# Altium schematic sheet P06_DEBUG UART_RTC_WD.SchDoc
size 420 x 297 mm
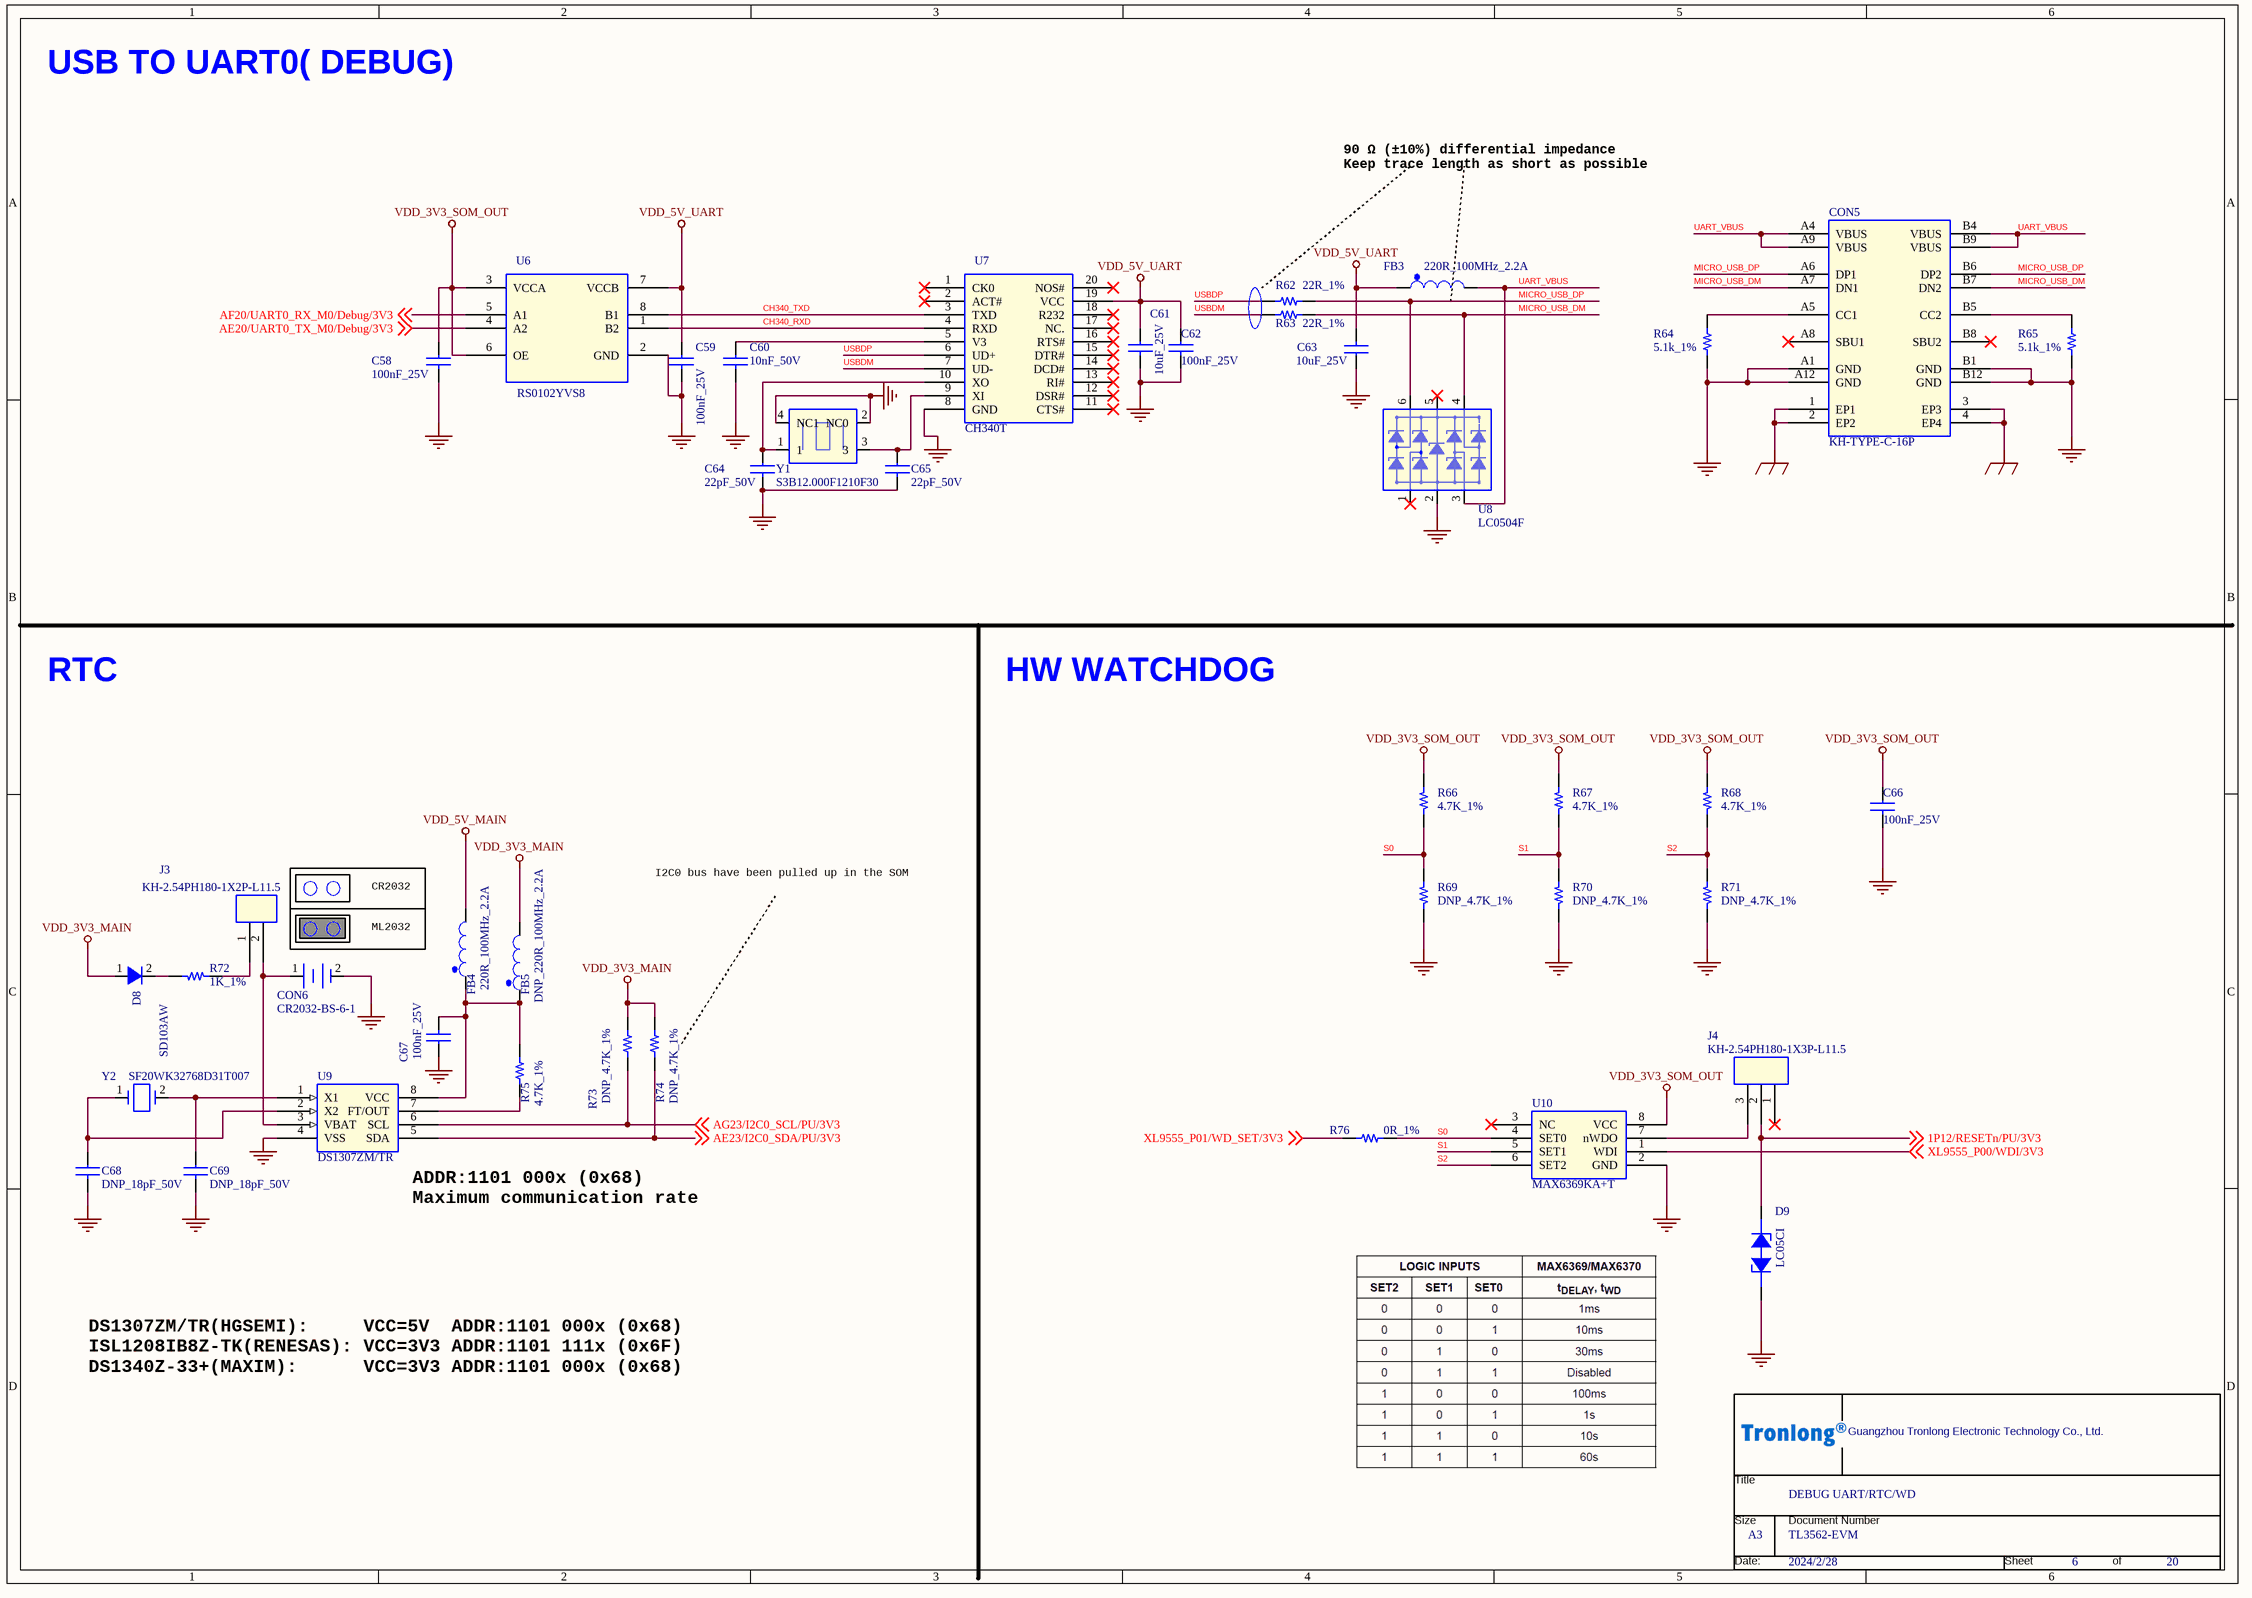
[diagram p0: P06_DEBUG UART_RTC_WD.SchDoc]

## Parts
*  Page Count: 20  Page Number: 6  Page Size: A3  OrgName: Guangzhou Tronlong Electronic Technology Co., Ltd.  Title: DEBUG UART/RTC/WD  Doc: TL3562-EVM  Page Modify Date: 2024/2/28  (hidden comment: Tronlong_TITTLE_20211115)  (graphical)
C58  100nF_25V  [C0402]
C59  100nF_25V  [C0402]
C60  10nF_50V  [C0402]
C61  10uF_25V  [C0603]
C62  100nF_25V  [C0402]
C63  10uF_25V  [C0603]
C64  22pF_50V  [C0603]
C65  22pF_50V  [C0603]
C66  100nF_25V  [C0402]
C67  100nF_25V  [C0402]
C68  DNP_18pF_50V  [C0603]
C69  DNP_18pF_50V  [C0603]
CON5  KH-TYPE-C-16P  [TYPE-C_16P_90_SMD]
CON6  CR2032-BS-6-1  [CON_BATTERY_CR2032]
D8  SD103AW  [SOD-123_NEW]
D9  LC05CI  [SOD323_BI]
FB3  220R_100MHz_2.2A  [L0603]
FB4  220R_100MHz_2.2A  [L0603]
FB5  DNP_220R_100MHz_2.2A  [L0603]
J3  KH-2.54PH180-1X2P-L11.5  [header_1x2p_2d54_male]
J4  KH-2.54PH180-1X3P-L11.5  [CON3_2D254]
R62  22R_1%  [R0402]
R63  22R_1%  [R0402]
R64  5.1k_1%  [R0402]
R65  5.1k_1%  [R0402]
R66  4.7K_1%  [R0402]
R67  4.7K_1%  [R0402]
R68  4.7K_1%  [R0402]
R69  DNP_4.7K_1%  [R0402]
R70  DNP_4.7K_1%  [R0402]
R71  DNP_4.7K_1%  [R0402]
R72  1K_1%  [R0402]
R73  DNP_4.7K_1%  [R0402]
R74  DNP_4.7K_1%  [R0402]
R75  4.7K_1%  [R0402]
R76  0R_1%  [R0402]
U6  RS0102YVS8  [SOP8-20-91]
U7  CH340T  [TSSOP-20]
U8  LC0504F  [SOT363]
U9  DS1307ZM/TR  [SOIC8_D8]
U10  MAX6369KA+T  [sot23_8]
Y1  S3B12.000F1210F30  [SMD_3225]
Y2  SF20WK32768D31T007  [SMD_2012]

## Nets
EGND: CON5.1(EP1) CON5.2(EP2) CON5.3(EP3) CON5.4(EP4)
GND: C58.2 C59.2 C60.2 C61.2 C62.2 C63.1 C64.2 C65.2 C66.2 C67.1 C68.2 C69.2 CON5.A1(GND) CON5.A12(GND) CON5.B1(GND) CON5.B12(GND) CON6.2(-) D9.2(CATHODE2) R64.2 R65.2 R69.2 R70.2 R71.2 U6.2(GND) U7.8(GND) U8.2 U9.4(VSS) U10.2(GND) Y1.2(NC0) Y1.4(NC1)
VDD_3V3_MAIN: D8.1(Anode) FB5.2 R73.1 R74.1
VDD_3V3_SOM_OUT: C58.1 C66.1 R66.1 R67.1 R68.1 U6.3(VCCA) U6.6(OE) U10.8(VCC)
VDD_5V_MAIN: FB4.2
VDD_5V_UART: C59.1 C61.1 C62.1 C63.2 FB3.1 U6.7(VCCB) U7.19(VCC)
1P12/RESETn/PU/3V3: D9.1(ANODE1) J4.2 ; off-sheet 1P12/RESETn/PU/3V3
AE20/UART0_TX_M0/Debug/3V3: U6.4(A2) ; off-sheet AE20/UART0_TX_M0/Debug/3V3
AE23/I2C0_SDA/PU/3V3: R74.2 U9.5(SDA) ; off-sheet AE23/I2C0_SDA/PU/3V3
AF20/UART0_RX_M0/Debug/3V3: U6.5(A1) ; off-sheet AF20/UART0_RX_M0/Debug/3V3
AG23/I2C0_SCL/PU/3V3: R73.2 U9.6(SCL) ; off-sheet AG23/I2C0_SCL/PU/3V3
CH340_RXD: U6.1(B2) U7.4(RXD)
CH340_TXD: U6.8(B1) U7.3(TXD)
MICRO_USB_DM: CON5.A7(DN1) CON5.B7(DN2) R63.2 U8.4
MICRO_USB_DP: CON5.A6(DP1) CON5.B6(DP2) R62.2 U8.6
S0: R66.2 R69.1 R76.1 U10.4(SET0)
S1: R67.2 R70.1 U10.5(SET1)
S2: R68.2 R71.1 U10.6(SET2)
UART_VBUS: CON5.A4(VBUS) CON5.A9(VBUS) CON5.B4(VBUS) CON5.B9(VBUS) FB3.2 U8.3
USBDM: R63.1 U7.7(UD-)
USBDP: R62.1 U7.6(UD+)
XL9555_P00/WDI/3V3: U10.1(WDI) ; off-sheet XL9555_P00/WDI/3V3
XL9555_P01/WD_SET/3V3: R76.2 ; off-sheet XL9555_P01/WD_SET/3V3
NetC60_1: C60.1 U7.5(V3)
NetC64_1: C64.1 U7.10(XO) Y1.1
NetC65_1: C65.1 U7.9(XI) Y1.3
NetC67_2: C67.2 FB4.1 FB5.1 R75.1 U9.8(VCC)
NetC68_1: C68.1 U9.2(X2) Y2.1
NetC69_1: C69.1 U9.1(X1) Y2.2
NetCON5_A5: CON5.A5(CC1) R64.1
NetCON5_B5: CON5.B5(CC2) R65.1
NetCON6_1: CON6.1(+) J3.2 U9.3(VBAT)
NetD8_2: D8.2(Cathode) R72.2
NetJ3_1: J3.1 R72.1
NetJ4_3: J4.3 U10.7(nWDO)
NetR75_2: R75.2 U9.7(FT/OUT)

Not connected (* = marked no-connect by the designer): CON5 A8(SBU1)* B8(SBU2)*; J4 1*; U7 1(CK0)* 2(ACT#)* 11(CTS#)* 12(DSR#)* 13(RI#)* 14(DCD#)* 15(DTR#)* 16(RTS#)* 17(NC.)* 18(R232)* 20(NOS#)*; U8 1* 5*; U10 3(NC)*

## Notes on the sheet
- USB TO UART0( DEBUG)
- 90 Ω (±10%) differential impedance
  Keep trace length as short as possible
- RTC
- HW WATCHDOG
- ML2032
- CR2032
- I2C0 bus have been pulled up in the SOM
- (near U9) ADDR:1101 000x (0x68)
  Maximum communication rate 100KHz
- DS1307ZM/TR(HGSEMI):     VCC=5V  ADDR:1101 000x (0x68)
  ISL1208IB8Z-TK(RENESAS): VCC=3V3 ADDR:1101 111x (0x6F)
  DS1340Z-33+(MAXIM):      VCC=3V3 ADDR:1101 000x (0x68)
- (in symbol Tronlong_TITTLE_20211115) Title; Size; Document Number; Date:; Sheet; of

## Library data of the parts
* = Tronlong_TITTLE_20211115: RevCode: A?; Page Create Date: March  8, 1995
C58 C59 C62 C66 C67 = CAP NP_Dup3: 贴片陶瓷电容,100nF,10%,25V,X5R; Manufacturer Character: 中国大陆; Operation Temperature（℃）: -55~85℃; As-Welded: /; PCB Footprint: C0402; Temperature: -55~125℃
C60 = CAP NP_Dup3: 贴片陶瓷电容,10nF,10%,50V,X7R; Manufacturer Character: 中国大陆; Operation Temperature（℃）: -55~125℃; As-Welded: /; PCB Footprint: C0402; Temperature: –55~125℃
C61 C63 = CAP NP_Dup3: 贴片陶瓷电容,10uF,10%,10V,X5R; Manufacturer Character: 中国大陆; As-Welded: /; Operation Temperature（℃）: -55~85℃; PCB Footprint: C0603; Temperature: -55~125℃
C64 C65 = CAP NP_Dup3: 贴片陶瓷电容,22pF,5%,50V,C0G; Manufacturer Character: 中国大陆; Operation Temperature（℃）: -55~125℃; As-Welded: /; PCB Footprint: C0603; Temperature: -55~125℃
C68 C69 = CAP NP_Dup3: 贴片陶瓷电容,18pF,5%,50V,C0G; Manufacturer Character: 中国大陆; Operation Temperature（℃）: -55~125℃; As-Welded: DNP; PCB Footprint: C0603; Temperature: -40~125℃
CON5 = usb 3_0.0 type-c female: Type-C 母座 90度 16 Pin; Manufacturer Character: 中国大陆; Manufacturer: 深圳市金航标电子有限公司(kinghelm); Operation Temperature（℃）: -40~85℃; room: 10; As-Welded: /; Manufacturer PartNumber: KH-TYPE-C-16P; PCB Footprint: TYPE-C_16P_90_SMD
CON6 = BATTERY: 2032,纽扣电池座,2PIN,180度,白色,卧式,贴片; Manufacturer: 深圳市琦捷电子有限公司（Q&J）; Manufacturer Character: 中国大陆; As-Welded: /; room: 4; Manufacturer PartNumber: CR2032-BS-6-1; Temperature: -55~85℃; PCB Footprint: CON_BATTERY_CR2032
D8 = Diode200mA250V_1: 肖特基二极管,VR=40V,IF=350mA,VF=0.37V@20mA,trr=10ns; TIIntPartnumber: 1E0013; MfrNum: MMSD103T1G; Mfr: On Semiconductor; Manufacturer: 江苏长晶科技有限公司（JSCJ）; Manufacturer Character: 中国大陆; DescriptiveText: Diode 200mA 250V 1.25V Forward Drop; PCB Footprint: smd123; Cost10K: 0.07; Cost100: 0.23; Vendor: Digikey; As-Welded: /; Operation Temperature（℃）: -40~125℃; PartName: Diode200mA250V; Descriptive_Text: Diode 200mA 250V 1.25V Forward Drop; Manufacturer PartNumber: SD103AW; Temperature: -55~150℃
D9 = DIODE BREAKDOWN_2: TVS二极管,VRWM=5V,VBR=6V,一组,双向,30KV,30KV; Manufacturer Part Number: PESD3V3L1BA; Manufacturer: 上海雷卯电子科技有限公司（Leiditech）; Manufacturer Character: 中国大陆; room: KEY; Operation Temperature（℃）: -55~125℃; As-Welded: /; Temperature: -55~155℃; Manufacturer PartNumber: LC05CI; PCB Footprint: SOD323_BI
FB3 = FERRITE BEAD_Dup2: 磁珠,50mΩ,2.2A,220R@100MHz; Manufacturer: 深圳顺络电子股份有限公司（Sunlord）; Manufacturer PartNumber: UPZ1608U221-2R2TF; Manufacturer Character: 中国大陆; As-Welded: /; Operation Temperature（℃）: -55~125℃; Temperature: -55~125℃; PCB Footprint: L0603
FB4 = FERRITE BEAD_Dup2: 磁珠,50mΩ,2.2A,220R@100MHz; Manufacturer Character: 中国大陆; Manufacturer PartNumber: UPZ1608U221-2R2TF; Manufacturer: 深圳顺络电子股份有限公司（Sunlord）; As-Welded: /; Operation Temperature（℃）: -55~125℃; room: RGMII1; Temperature: -55~125℃; PCB Footprint: L0603
FB5 = FERRITE BEAD_Dup2: 磁珠,50mΩ,2.2A,220R@100MHz; Manufacturer PartNumber: UPZ1608U221-2R2TF; Manufacturer: 深圳顺络电子股份有限公司（Sunlord）; Manufacturer Character: 中国大陆; As-Welded: DNP; room: RGMII1; Operation Temperature（℃）: -55~125℃; Temperature: -55~125℃; PCB Footprint: L0603
J3 = CON2_0: 排针,1x2PIN,间距2.54MM,180度,黑色,插件; Manufacturer Character: 中国大陆; Manufacturer: 深圳市金航标电子有限公司(kinghelm); Operation Temperature（℃）: -55~105℃; As-Welded: /; PCB Footprint: header_1x2p_2d54_male; Manufacturer PartNumber: KH-2.54PH180-1X2P-L11.5; Temperature: -40~105℃
J4 = CON3_Dup2: 排针,1x3PIN,间距2.54MM,180度,黑色,插件; Manufacturer: 深圳市金航标电子有限公司(kinghelm); Manufacturer Character: 中国大陆; room: DAC; Operation Temperature（℃）: -55~105℃; As-Welded: /; PCB Footprint: CON3_2D254; Manufacturer PartNumber: KH-2.54PH180-1X3P-L11.5; Temperature: -55~105℃
R62 R63 = Resistor_Dup3: 贴片电阻,22R,±1%,1/16W; Manufacturer Character: 中国大陆; CLASS: DISCRETE; As-Welded: /; Operation Temperature（℃）: -55~155℃; PCB Footprint: R0402; Temperature: -55~155℃
R64 R65 = Resistor_Dup3: 贴片电阻,5.1K,±1%,1/16W; Manufacturer Character: 中国大陆; CLASS: DISCRETE; Operation Temperature（℃）: -55~155℃; room: JTAG; As-Welded: /; PCB Footprint: R0402; Temperature: -55~125℃
R66-R68 R75 = Resistor_Dup3: 贴片电阻,4.7K,±1%,1/16W; Manufacturer Character: 中国大陆; CLASS: DISCRETE; Operation Temperature（℃）: -55~155℃; As-Welded: /; PCB Footprint: R0402; Temperature: -55~155℃
R69 R70 R74 = Resistor_Dup3: 贴片电阻,4.7K,±1%,1/16W; Manufacturer Character: 中国大陆; CLASS: DISCRETE; Operation Temperature（℃）: -55~155℃; As-Welded: DNP; Temperature: -55~155℃; PCB Footprint: R0402
R71 R73 = Resistor_Dup3: 贴片电阻,4.7K,±1%,1/16W; Manufacturer Character: 中国大陆; CLASS: DISCRETE; As-Welded: DNP; Operation Temperature（℃）: -55~155℃; Temperature: -55~155℃; PCB Footprint: R0402
R72 = Resistor_Dup3: 贴片电阻,1K,±1%,1/16W; Manufacturer Character: 中国大陆; CLASS: DISCRETE; As-Welded: /; Operation Temperature（℃）: -55~155℃; room: EEPROM/RTC; PCB Footprint: R0402
R76 = Resistor_Dup3: 0R,±1%,R0402,≥1/16W; Manufacturer Character: 中国大陆; CLASS: DISCRETE; Operation Temperature（℃）: -55~155℃; As-Welded: /; PCB Footprint: R0402
U6 = TXS0102DCUR: 2位双向电平转换器; Manufacturer: 江苏润石科技有限公司（RUNIC）; Manufacturer Character: 中国大陆; As-Welded: /; Operation Temperature（℃）: -40~85℃; Temperature: -40~85℃; Manufacturer PartNumber: RS0102YVS8; PCB Footprint: SOP8-20-91
U7 = CH340T: USB转UART芯片; Manufacturer Character: 中国大陆; Manufacturer: 南京沁恒微电子股份有限公司（WCH）; As-Welded: /; Operation Temperature（℃）: -40~85℃; Temperature: -40~85℃; Manufacturer PartNumber: CH340T; PCB Footprint: TSSOP-20
U8 = PRTR5V0U4Y_0: ESD二极管,VRWM=5V,VBR=6V,四组,单向,8KV,15KV; Manufacturer: 上海雷卯电子科技有限公司（Leiditech）; Manufacturer Character: 中国大陆; As-Welded: /; room: SD; Operation Temperature（℃）: -55~125℃; Manufacturer Part Number: PRTR5V0U4Y; Manufacturer PartNumber: LC0504F; Temperature: -40~85℃; PCB Footprint: SOT363
U9 = IC_MCP79410_0: RTC芯片; Manufacturer Character: 中国大陆; Manufacturer: 广东华冠半导体有限公司（HGSEMI）; As-Welded: /; Operation Temperature（℃）: -40~85℃; Temperature: -40~85℃; Manufacturer PartNumber: DS1307ZM/TR; PCB Footprint: SOIC8_D8
U10 = MAX637x: 低电平有效开漏输出,2.5V-5.5V,-40~125℃; Manufacturer Character: 国外; Manufacturer: Maxim Integrated（美国美信）; As-Welded: /; Temperature: -40~125℃; Manufacturer PartNumber: MAX6369KA+T; Operation Temperature（℃）: -40~125℃; PCB Footprint: sot23_8
Y1 = CRYSTAL: 四脚无源晶振,12MHz,±10ppm,12pF,100Ω,±30ppm; Manufacturer Character: 中国大陆; Manufacturer: 深圳市星通时频电子有限公司公司（JSCJ）; As-Welded: /; Operation Temperature（℃）: -40~85℃; Temperature: -40~85℃; Manufacturer PartNumber: S3B12.000F1210F30; PCB Footprint: SMD_3225
Y2 = CRYS_32_768KHz_SMD: 两脚无源晶振,32.768KHz,±20ppm,12.5pF,80KΩ,±20ppm; PartName: Crystal32.768KHzMC306; Mfr: Epson; MfrNum: MC-30632.7680k-A; TIIntPartnumber: 1Y0029; Manufacturer: 湖北泰晶电子科技股份有限公司（TKD）; Manufacturer Character: 中国大陆; TN: tbd; Vendor: Digikey; Cost100: 0.41; Cost10K: 0.338; PCB Footprint: smd; As-Welded: /; Operation Temperature（℃）: -40~85℃; Manufacturer PartNumber: SF20WK32768D31T007; Temperature: -40~85℃